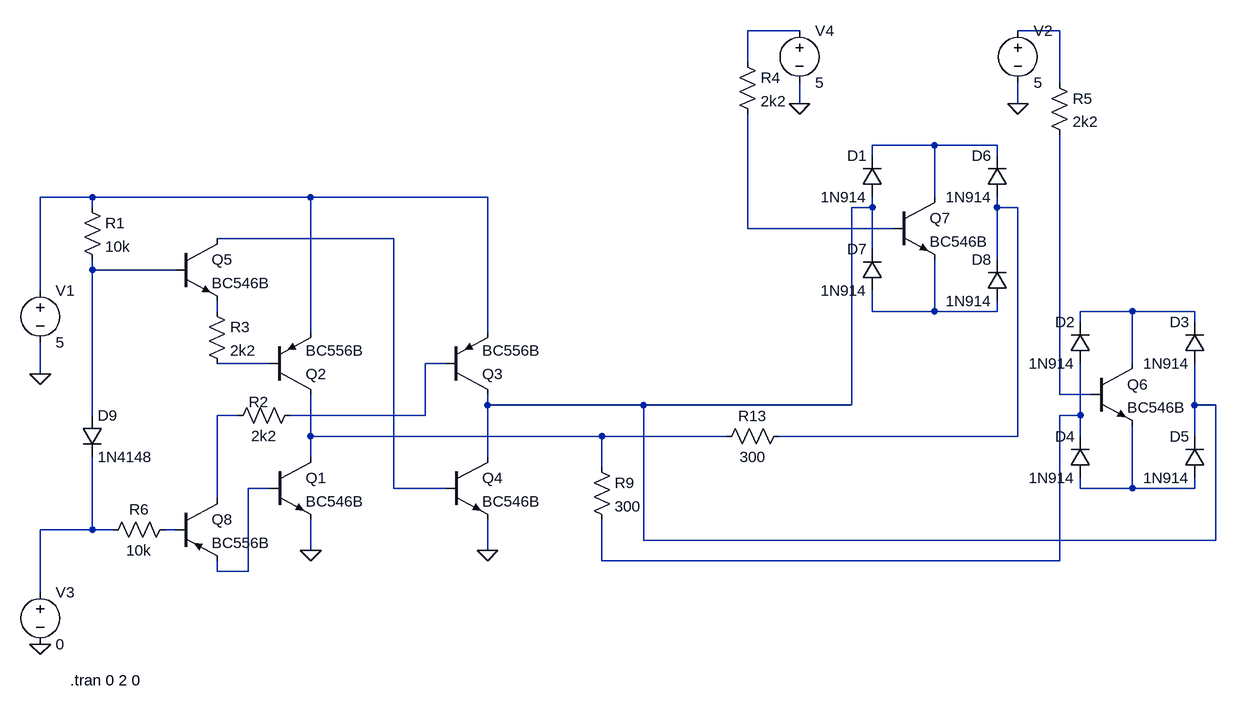
[diagram p0: schematic TriSateSwitch.asc]
TriSateSwitch.asc, the LTspice schematic file:
Version 4
SHEET 1 1556 680
WIRE 864 -416 784 -416
WIRE 1264 -416 1200 -416
WIRE 784 -368 784 -416
WIRE 1264 -336 1264 -416
WIRE 864 -304 864 -336
WIRE 1200 -304 1200 -336
WIRE 1072 -240 976 -240
WIRE 1168 -240 1072 -240
WIRE 976 -224 976 -240
WIRE 1168 -224 1168 -240
WIRE -224 -160 -304 -160
WIRE 112 -160 -224 -160
WIRE 384 -160 112 -160
WIRE 1072 -160 1072 -240
WIRE -224 -144 -224 -160
WIRE 976 -144 976 -160
WIRE 976 -144 944 -144
WIRE 1168 -144 1168 -160
WIRE 1200 -144 1168 -144
WIRE 784 -112 784 -288
WIRE 1008 -112 784 -112
WIRE 240 -96 -32 -96
WIRE 976 -80 976 -144
WIRE 1168 -64 1168 -144
WIRE -224 -48 -224 -64
WIRE -96 -48 -224 -48
WIRE -304 -16 -304 -160
WIRE -32 16 -32 0
WIRE 976 16 976 -16
WIRE 1072 16 1072 -64
WIRE 1072 16 976 16
WIRE 1168 16 1168 0
WIRE 1168 16 1072 16
WIRE 1376 16 1296 16
WIRE 1472 16 1376 16
WIRE 1296 32 1296 16
WIRE 1472 32 1472 16
WIRE 112 48 112 -160
WIRE 384 48 384 -160
WIRE 48 96 -32 96
WIRE 320 96 288 96
WIRE 1376 96 1376 16
WIRE -304 112 -304 64
WIRE 1264 144 1264 -256
WIRE 1312 144 1264 144
WIRE 384 160 384 144
WIRE 624 160 384 160
WIRE 944 160 944 -144
WIRE 944 160 624 160
WIRE 1472 160 1472 96
WIRE 1504 160 1472 160
WIRE -224 176 -224 -48
WIRE 0 176 -32 176
WIRE 288 176 288 96
WIRE 288 176 80 176
WIRE 1296 176 1296 96
WIRE 1296 176 1264 176
WIRE 112 208 112 144
WIRE 560 208 112 208
WIRE 752 208 560 208
WIRE 1200 208 1200 -144
WIRE 1200 208 832 208
WIRE 1296 208 1296 176
WIRE 1472 208 1472 160
WIRE 112 240 112 208
WIRE 384 240 384 160
WIRE 560 256 560 208
WIRE 48 288 16 288
WIRE 240 288 240 -96
WIRE 320 288 240 288
WIRE 1296 288 1296 272
WIRE 1376 288 1376 192
WIRE 1376 288 1296 288
WIRE 1472 288 1472 272
WIRE 1472 288 1376 288
WIRE -32 304 -32 176
WIRE -224 352 -224 240
WIRE -224 352 -304 352
WIRE -192 352 -224 352
WIRE -96 352 -112 352
WIRE 624 368 624 160
WIRE 1504 368 1504 160
WIRE 1504 368 624 368
WIRE 112 384 112 336
WIRE 384 384 384 336
WIRE 560 400 560 336
WIRE 1264 400 1264 176
WIRE 1264 400 560 400
WIRE -32 416 -32 400
WIRE 16 416 16 288
WIRE 16 416 -32 416
WIRE -304 448 -304 352
FLAG 112 384 0
FLAG 384 384 0
FLAG -304 112 0
FLAG 864 -304 0
FLAG 1200 -304 0
FLAG -304 528 0
SYMBOL voltage -304 -32 R0
WINDOW 123 0 0 Left 2
WINDOW 39 0 0 Left 2
SYMATTR InstName V1
SYMATTR Value 5
SYMBOL npn 48 240 R0
SYMATTR InstName Q1
SYMATTR Value BC546B
SYMBOL pnp 48 144 M180
SYMATTR InstName Q2
SYMATTR Value BC556B
SYMBOL npn 320 240 R0
SYMATTR InstName Q4
SYMATTR Value BC546B
SYMBOL res -48 0 R0
SYMATTR InstName R3
SYMATTR Value 2k2
SYMBOL res 96 160 R90
WINDOW 0 11 64 VBottom 2
WINDOW 3 32 56 VTop 2
SYMATTR InstName R2
SYMATTR Value 2k2
SYMBOL npn -96 -96 R0
SYMATTR InstName Q5
SYMATTR Value BC546B
SYMBOL pnp 320 144 M180
SYMATTR InstName Q3
SYMATTR Value BC556B
SYMBOL diode 1312 96 R180
WINDOW 0 24 64 Left 2
WINDOW 3 24 0 Left 2
SYMATTR InstName D2
SYMATTR Value 1N914
SYMBOL diode 1488 96 R180
WINDOW 0 24 64 Left 2
WINDOW 3 24 0 Left 2
SYMATTR InstName D3
SYMATTR Value 1N914
SYMBOL diode 1312 272 R180
WINDOW 0 24 64 Left 2
WINDOW 3 24 0 Left 2
SYMATTR InstName D4
SYMATTR Value 1N914
SYMBOL diode 1488 272 R180
WINDOW 0 24 64 Left 2
WINDOW 3 24 0 Left 2
SYMATTR InstName D5
SYMATTR Value 1N914
SYMBOL npn 1312 96 R0
SYMATTR InstName Q6
SYMATTR Value BC546B
SYMBOL pnp -96 304 R0
SYMATTR InstName Q8
SYMATTR Value BC556B
SYMBOL diode 992 -160 R180
WINDOW 0 24 64 Left 2
WINDOW 3 24 0 Left 2
SYMATTR InstName D1
SYMATTR Value 1N914
SYMBOL diode 1184 -160 R180
WINDOW 0 24 64 Left 2
WINDOW 3 24 0 Left 2
SYMATTR InstName D6
SYMATTR Value 1N914
SYMBOL diode 992 -16 R180
WINDOW 0 24 64 Left 2
WINDOW 3 24 0 Left 2
SYMATTR InstName D7
SYMATTR Value 1N914
SYMBOL diode 1184 0 R180
WINDOW 0 24 64 Left 2
WINDOW 3 24 0 Left 2
SYMATTR InstName D8
SYMATTR Value 1N914
SYMBOL npn 1008 -160 R0
SYMATTR InstName Q7
SYMATTR Value BC546B
SYMBOL res 768 -384 R0
SYMATTR InstName R4
SYMATTR Value 2k2
SYMBOL res 1248 -352 R0
SYMATTR InstName R5
SYMATTR Value 2k2
SYMBOL voltage 864 -432 R0
WINDOW 123 0 0 Left 2
WINDOW 39 0 0 Left 2
SYMATTR InstName V4
SYMATTR Value 5
SYMBOL res 544 240 R0
SYMATTR InstName R9
SYMATTR Value 300
SYMBOL res 736 224 R270
WINDOW 0 32 56 VTop 2
WINDOW 3 0 56 VBottom 2
SYMATTR InstName R13
SYMATTR Value 300
SYMBOL res -240 -160 R0
SYMATTR InstName R1
SYMATTR Value 10k
SYMBOL voltage 1200 -432 R0
WINDOW 123 0 0 Left 2
WINDOW 39 0 0 Left 2
SYMATTR InstName V2
SYMATTR Value 5
SYMBOL res -96 336 R90
WINDOW 0 0 56 VBottom 2
WINDOW 3 32 56 VTop 2
SYMATTR InstName R6
SYMATTR Value 10k
SYMBOL diode -240 176 R0
SYMATTR InstName D9
SYMATTR Value 1N4148
SYMBOL voltage -304 432 R0
WINDOW 123 0 0 Left 2
WINDOW 39 0 0 Left 2
SYMATTR InstName V3
SYMATTR Value 0
TEXT -258 584 Left 2 !.tran 0 2 0

The netlist it stands for:
* TriSateSwitch.asc
V1 N004 0 5
Q1 N018 N019 0 0 BC546B
Q2 N018 N013 N004 0 BC556B
Q4 N005 N008 0 0 BC546B
R3 N010 N013 2k2
R2 N014 N016 2k2
Q5 N008 N009 N010 0 BC546B
Q3 N005 N014 N004 0 BC556B
D2 N017 N012 1N914
D3 N005 N012 1N914
D4 N020 N017 1N914
D5 N020 N005 1N914
Q6 N012 N015 N020 0 BC546B
Q8 N016 N022 N019 0 BC556B
D1 N005 N003 1N914
D6 N006 N003 1N914
D7 N011 N005 1N914
D8 N011 N006 1N914
Q7 N003 N007 N011 0 BC546B
R4 N001 N007 2k2
R5 N002 N015 2k2
V4 N001 0 5
R9 N018 N017 300
R13 N018 N006 300
R1 N004 N009 10k
V2 N002 0 5
R6 N022 N021 10k
D9 N009 N021 1N4148
V3 N021 0 0
.model D D
.lib standard.dio
.model NPN NPN
.model PNP PNP
.lib standard.bjt
.tran 0 2 0
.backanno
.end